# EasyEDA schematic 1-Schematic_LoRaRice_node1.json
TITLE: LoRaRRice_node1; REV: 1.0; Date: 2023-12-07; Sheet: 1/1; Drawn By: Kridcharid; Company: 64346CPE
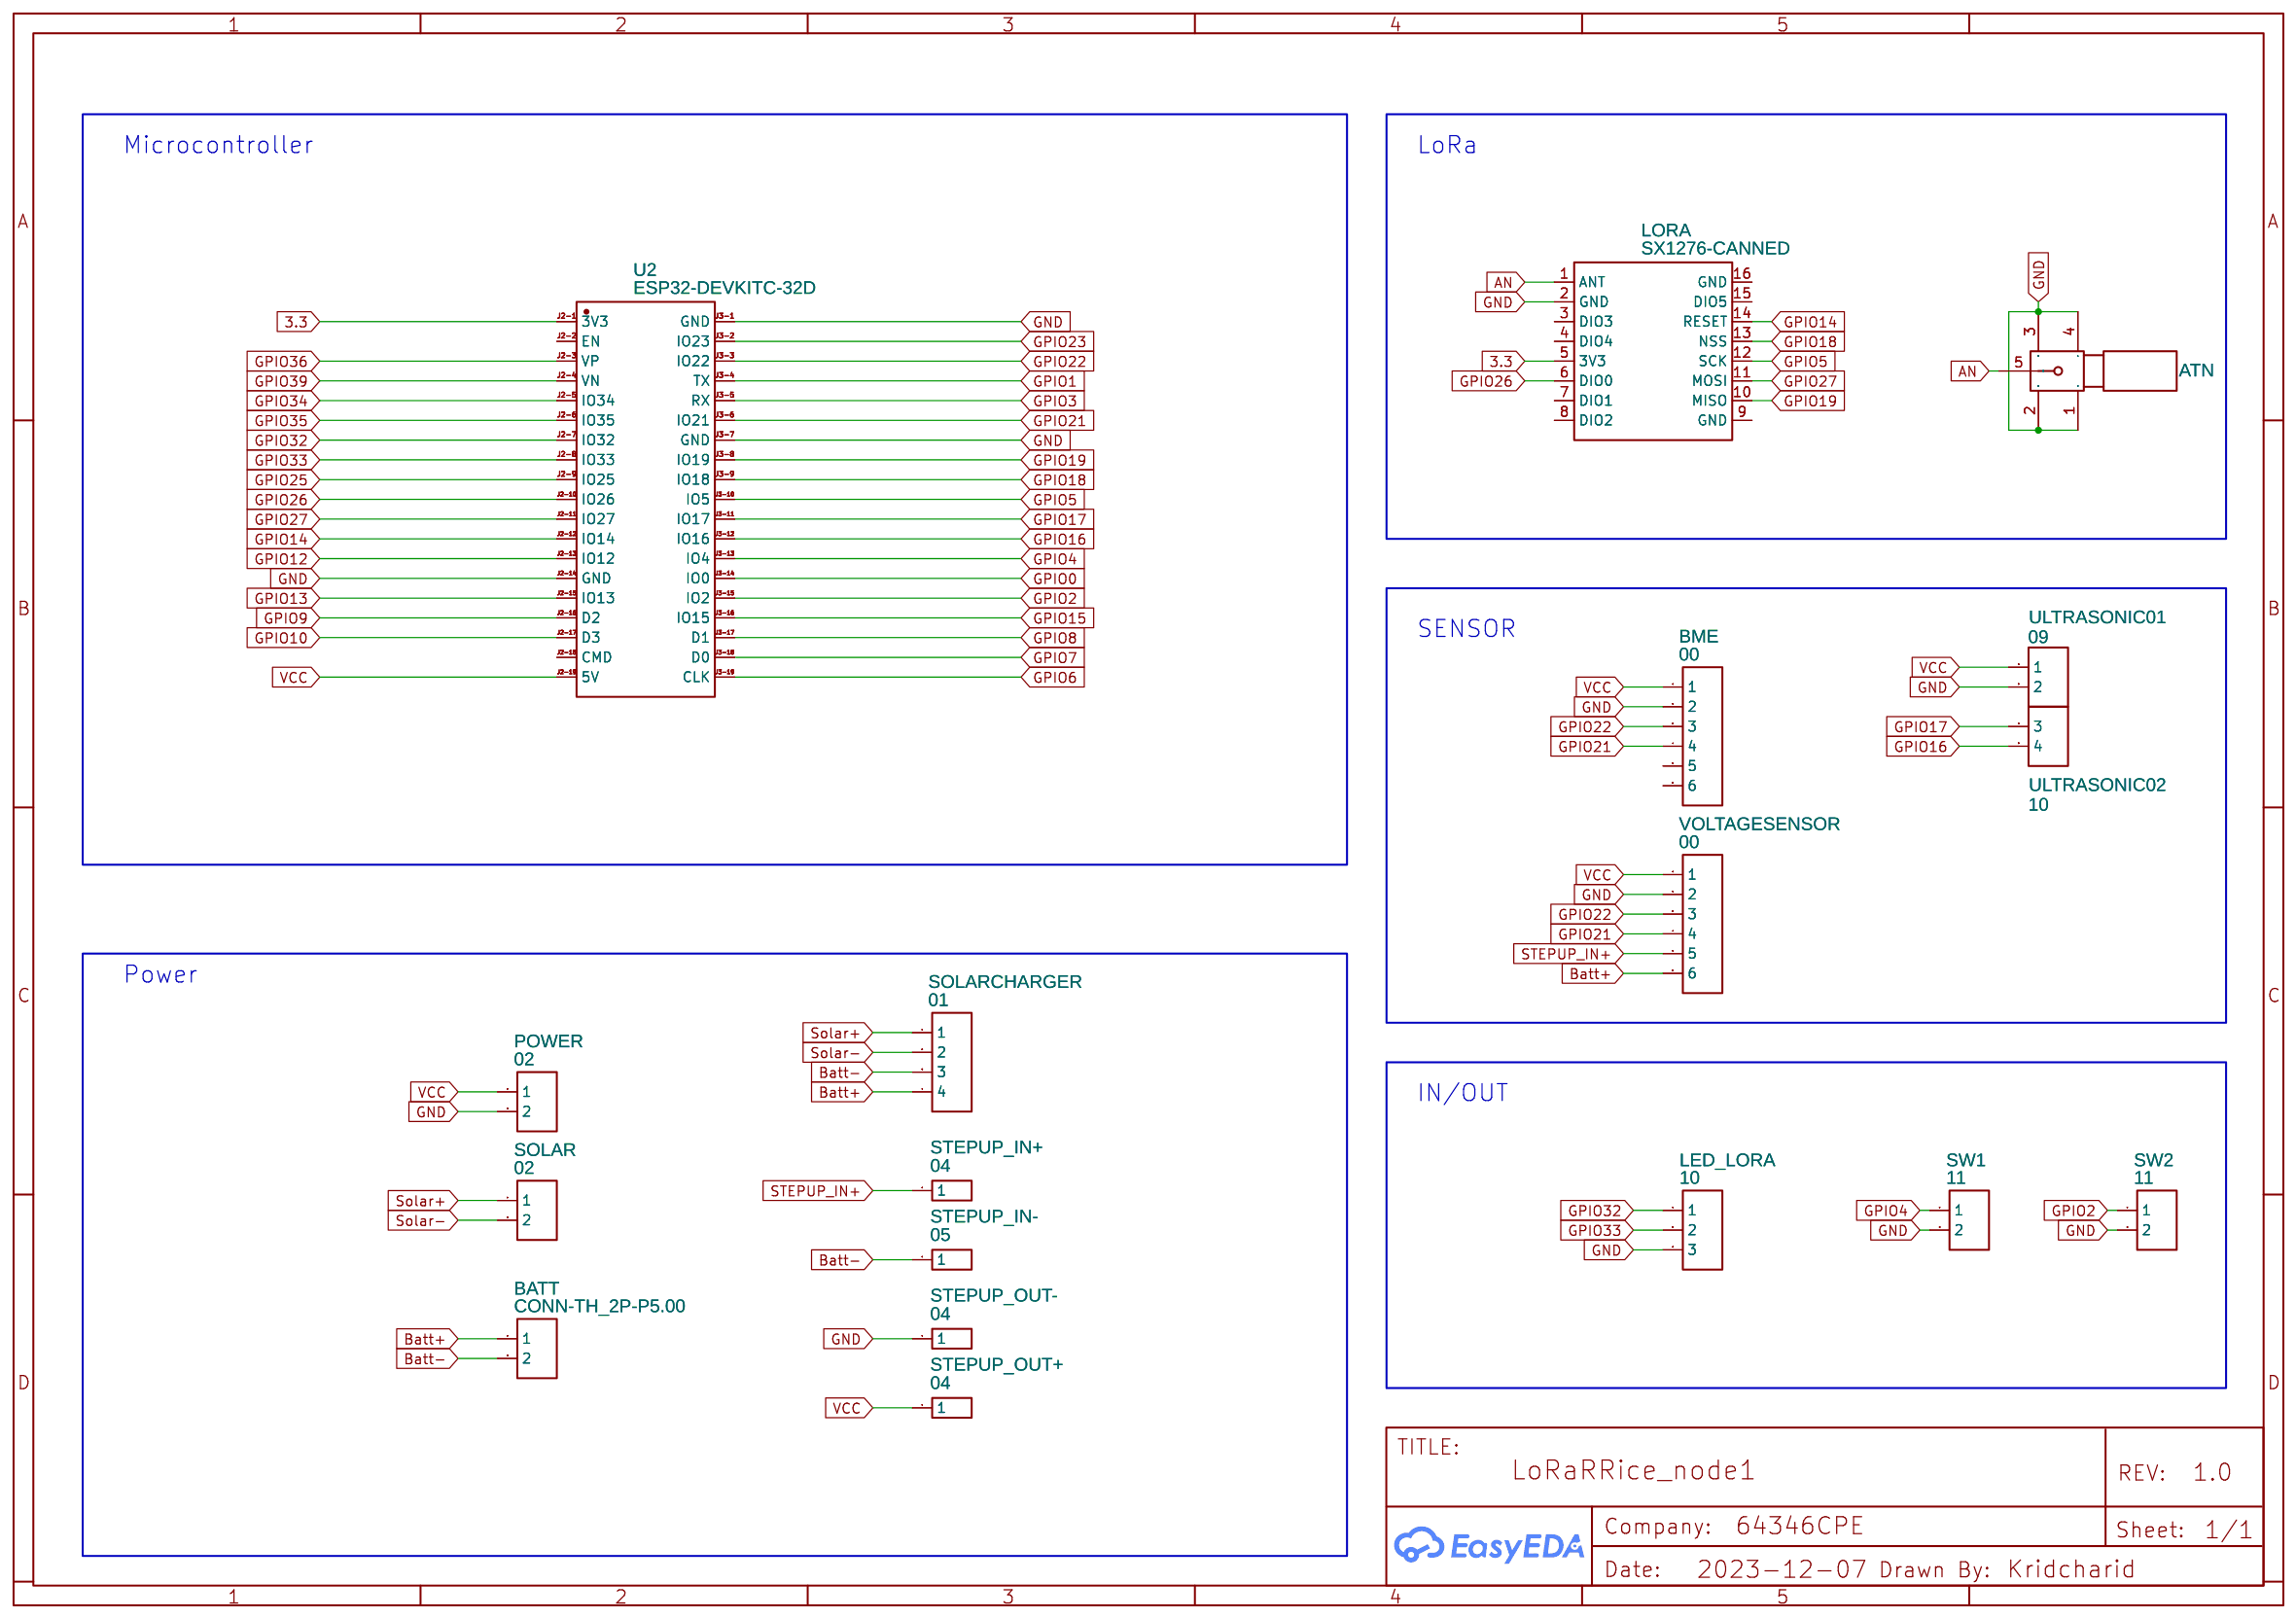
[diagram p0: schematic sheet]

## Parts
BATT  CONN-TH_2P-P5.00  [CONN-TH_2P-P5.00]
BME  00  [HDR-F-2.54_1X6]
LED_LORA  10  [CONN-TH_3P-P5.00]
LORA  SX1276-CANNED  [SX1276-CANNED]
POWER  02  [CONN-TH_2P-P5.00]
RF1  ATN  [SMA-SMD_BWSMA-KE-P001]
SOLAR  02  [CONN-TH_2P-P5.00]
SOLARCHARGER  01  [HDR-F-2.54_1X4]
STEPUP_IN+  04  [HDR-M-2.54_1X1]
STEPUP_IN-  05  [HDR-M-2.54_1X1]
STEPUP_OUT+  04  [HDR-M-2.54_1X1]
STEPUP_OUT-  04  [HDR-M-2.54_1X1]
SW1  11  [CONN-TH_2P-P5.00]
SW2  11  [CONN-TH_2P-P5.00]
U2  ESP32-DEVKITC-32D  [COMM-SMD_ESP32-DEVKITC-32D]
ULTRASONIC01  09  [CONN-TH_2P-P5.00]
ULTRASONIC02  10  [CONN-TH_2P-P5.00]
VOLTAGESENSOR  00  [HDR-F-2.54_1X6]

## Library data of the parts
BATT POWER SOLAR SW1 SW2 ULTRASONIC01 ULTRASONIC02 = CONN-TH_2P-P5.00: Supplier: LCSC; Contributor: LCEDA_Lib
BME VOLTAGESENSOR = HDR-F-2.54_1x6: Supplier Part: C40877; Supplier: LCSC; Contributor: LCEDA_Lib
LED_LORA = CONN-TH_3P-P5.00: Supplier: LCSC; Contributor: LCEDA_Lib
LORA = SX1276-CANNED: Manufacturer: G-NiceRF; Manufacturer Part: LoRa1276-C1; Supplier: Banggood; Supplier Part: Unknown; link: https://uk.banggood.com/LoRa1276-C1-SX1276-868MHz-LoRa-Module-Remote-Spread-Spectrum-Wireless-Module-20dBm-100mW-3-5KM-p-1416393.html?gmcCountry=GB¤cy=GBP&createTmp=1&utm_source=googleshopping&utm_medium=cpc_bgcs&utm_content=garman&utm_campaign=pla-gbg-ele-pc&gclid=EAIaIQobChMIouzku5XS4gIVipTtCh1cvgo9EAYYByABEgJIPfD_BwE&cur_warehouse=CN; Contributor: P-Thomsen
RF1 = BWSMA-KE-P001: Contributor: LCSC; Supplier: LCSC; Supplier Part: C496550; Manufacturer: BAT WIRELESS(蝙蝠无线); JLCPCB Part Class: Extended Part
SOLARCHARGER = HDR-F-2.54_1x4: Supplier Part: C225501; Supplier: LCSC; Contributor: LCEDA_Lib
STEPUP_IN+ STEPUP_IN- STEPUP_OUT+ STEPUP_OUT- = HDR-M-2.54_1x1: Supplier Part: C81276; Supplier: LCSC; Contributor: LCEDA_Lib
U2 = ESP32-DEVKITC-32D: Supplier: LCSC; Supplier Part: C571181; Manufacturer: ESPRESSIF(乐鑫); Manufacturer Part: ESP32-DevKitC-32D; JLCPCB Part Class: Extended Part; Contributor: lcsc

## Nets
GND: BME.2 LED_LORA.3 LORA.2(GND) POWER.2 RF1.1 RF1.2 RF1.3 RF1.4 STEPUP_OUT-.1 SW1.2 SW2.2 U2.J2-14(GND) U2.J3-1(GND) U2.J3-7(GND) ULTRASONIC01.2 VOLTAGESENSOR.2
VCC: BME.1 POWER.1 STEPUP_OUT+.1 U2.J2-19(5V) ULTRASONIC01.1 VOLTAGESENSOR.1
3.3: LORA.5(3V3) U2.J2-1(3V3)
AN: LORA.1(ANT) RF1.5
Batt+: BATT.1 SOLARCHARGER.4 VOLTAGESENSOR.6
Batt-: BATT.2 SOLARCHARGER.3 STEPUP_IN-.1
GPIO0: U2.J3-14(IO0)
GPIO1: U2.J3-4(TX)
GPIO2: SW2.1 U2.J3-15(IO2)
GPIO3: U2.J3-5(RX)
GPIO4: SW1.1 U2.J3-13(IO4)
GPIO5: LORA.12(SCK) U2.J3-10(IO5)
GPIO6: U2.J3-19(CLK)
GPIO7: U2.J3-18(D0)
GPIO8: U2.J3-17(D1)
GPIO9: U2.J2-16(D2)
GPIO10: U2.J2-17(D3)
GPIO12: U2.J2-13(IO12)
GPIO13: U2.J2-15(IO13)
GPIO14: LORA.14(RESET) U2.J2-12(IO14)
GPIO15: U2.J3-16(IO15)
GPIO16: U2.J3-12(IO16) ULTRASONIC02.2(4)
GPIO17: U2.J3-11(IO17) ULTRASONIC02.1(3)
GPIO18: LORA.13(NSS) U2.J3-9(IO18)
GPIO19: LORA.10(MISO) U2.J3-8(IO19)
GPIO21: BME.4 U2.J3-6(IO21) VOLTAGESENSOR.4
GPIO22: BME.3 U2.J3-3(IO22) VOLTAGESENSOR.3
GPIO23: U2.J3-2(IO23)
GPIO25: U2.J2-9(IO25)
GPIO26: LORA.6(DIO0) U2.J2-10(IO26)
GPIO27: LORA.11(MOSI) U2.J2-11(IO27)
GPIO32: LED_LORA.1 U2.J2-7(IO32)
GPIO33: LED_LORA.2 U2.J2-8(IO33)
GPIO34: U2.J2-5(IO34)
GPIO35: U2.J2-6(IO35)
GPIO36: U2.J2-3(VP)
GPIO39: U2.J2-4(VN)
Solar+: SOLAR.1 SOLARCHARGER.1
Solar-: SOLAR.2 SOLARCHARGER.2
STEPUP_IN+: STEPUP_IN+.1 VOLTAGESENSOR.5

Not connected (* = marked no-connect by the designer): BME 5 6; LORA 3(DIO3) 4(DIO4) 7(DIO1) 8(DIO2) 9(GND) 15(DIO5) 16(GND); U2 J2-2(EN) J2-18(CMD)

## Notes on the sheet
- Microcontroller
- LoRa
- SENSOR
- Power
- IN/OUT
